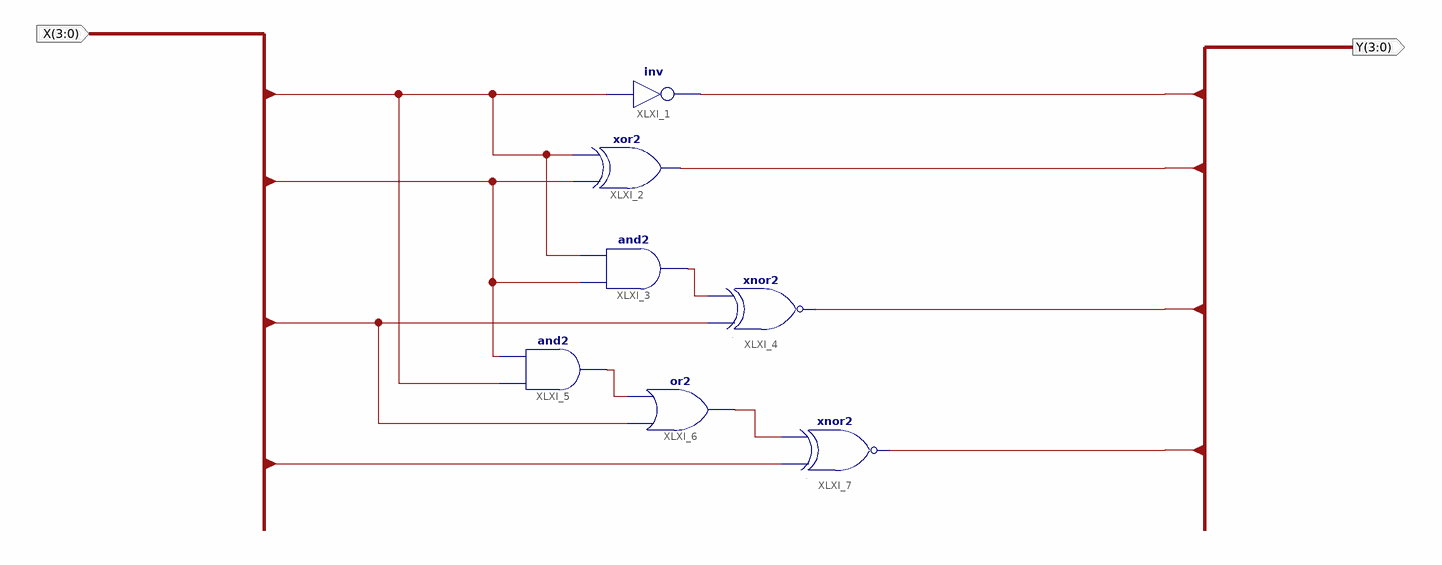
[diagram p0: schematic sheet 1]
// Xilinx ISE schematic schematTranskoder.sch (xc9500xl) as structural Verilog: 7 symbols, 2 ports
module schematTranskoder (
  input  [3:0] X,
  output [3:0] Y
);

  wire XLXN_11, XLXN_16, XLXN_17;

  not XLXI_1 (Y[0], X[0]);
  xor XLXI_2 (Y[1], X[1], X[0]);
  and XLXI_3 (XLXN_11, X[1], X[0]);
  xnor XLXI_4 (Y[2], X[2], XLXN_11);
  and XLXI_5 (XLXN_16, X[0], X[1]);
  or XLXI_6 (XLXN_17, X[2], XLXN_16);
  xnor XLXI_7 (Y[3], X[3], XLXN_17);
endmodule
